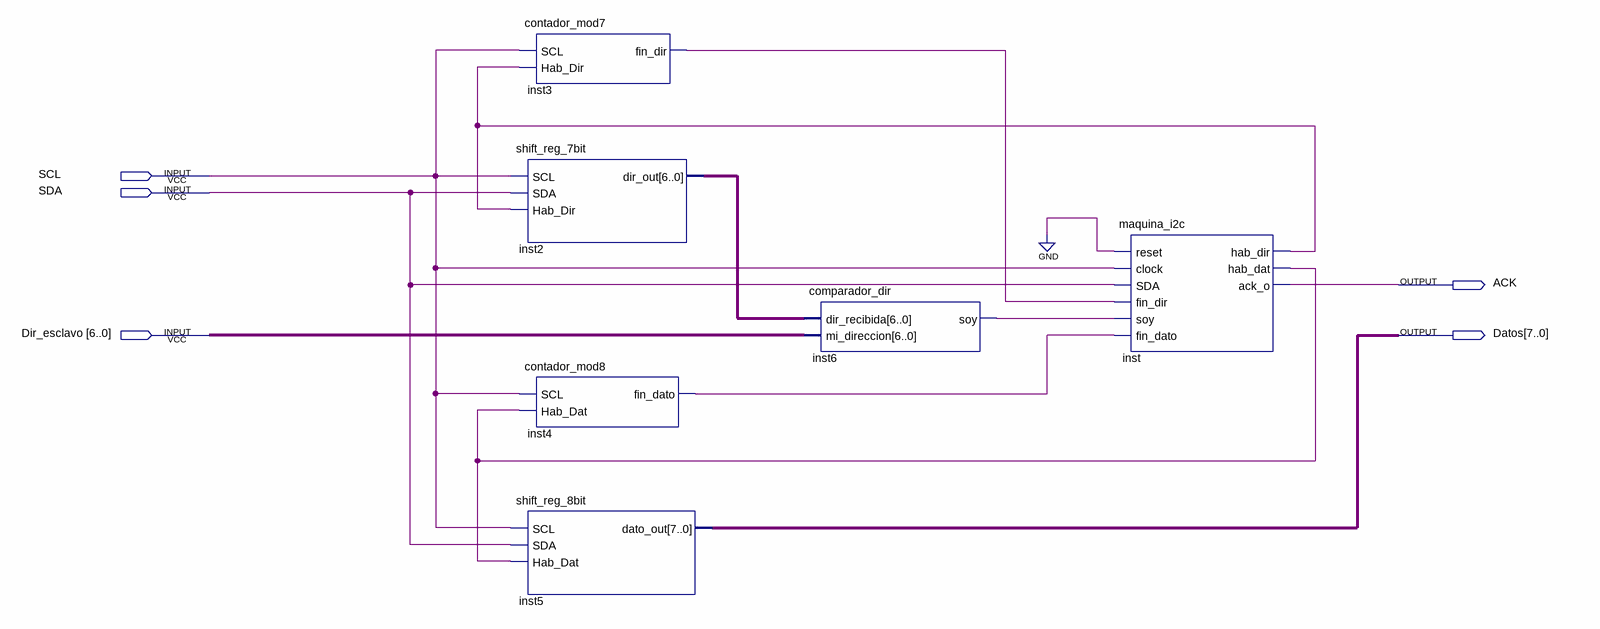
[diagram p0: schematic sheet]
// Quartus schematic parte_f.bdf as structural Verilog: 6 symbols, 5 pins
module parte_f (
  input  SCL,
  input  SDA,
  input  [6:0] Dir_esclavo,
  output ACK,
  output [7:0] Datos
);

  wire inst3_fin_dir, inst4_fin_dato, inst6_soy, inst_hab_dat, inst_hab_dir;
  wire [6:0] inst2_dir_out;

  shift_reg_7bit inst2 (.SCL(SCL), .SDA(SDA), .Hab_Dir(inst_hab_dir), .dir_out(inst2_dir_out));
  shift_reg_8bit inst5 (.SCL(SCL), .SDA(SDA), .Hab_Dat(inst_hab_dat), .dato_out(Datos));
  contador_mod7 inst3 (.SCL(SCL), .Hab_Dir(inst_hab_dir), .fin_dir(inst3_fin_dir));
  contador_mod8 inst4 (.SCL(SCL), .Hab_Dat(inst_hab_dat), .fin_dato(inst4_fin_dato));
  comparador_dir inst6 (.dir_recibida(inst2_dir_out), .mi_direccion(Dir_esclavo), .soy(inst6_soy));
  maquina_i2c inst (
    .reset(1'b0), .clock(SCL), .SDA(SDA), .fin_dir(inst3_fin_dir), .soy(inst6_soy),
    .fin_dato(inst4_fin_dato), .hab_dir(inst_hab_dir), .hab_dat(inst_hab_dat), .ack_o(ACK));
endmodule
